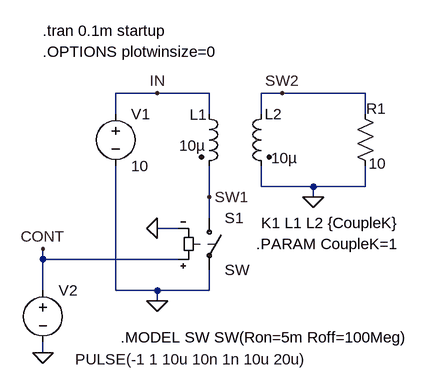
[diagram p0: schematic Fig_7-20_Inductor_SW-off_2A.asc]
Fig_7-20_Inductor_SW-off_2A.asc, the LTspice schematic file:
Version 4
SHEET 1 940 1020
WIRE 128 32 64 32
WIRE 208 32 128 32
WIRE 320 32 288 32
WIRE 448 32 320 32
WIRE 64 64 64 32
WIRE 208 64 208 32
WIRE 288 64 288 32
WIRE 448 64 448 32
WIRE 288 176 288 144
WIRE 368 176 288 176
WIRE 448 176 448 144
WIRE 448 176 368 176
WIRE 208 192 208 144
WIRE 368 192 368 176
WIRE 208 224 208 192
WIRE 160 240 128 240
WIRE -48 288 -48 272
WIRE 160 288 -48 288
WIRE -48 336 -48 288
WIRE 64 336 64 144
WIRE 128 336 64 336
WIRE 208 336 208 304
WIRE 208 336 128 336
WIRE 128 352 128 336
WIRE -48 432 -48 416
FLAG 128 352 0
FLAG 128 240 0
FLAG -48 272 CONT
FLAG -48 432 0
FLAG 208 192 SW1
FLAG 128 32 IN
FLAG 320 32 SW2
FLAG 368 192 0
SYMBOL voltage 64 48 R0
WINDOW 123 0 0 Left 2
WINDOW 39 0 0 Left 2
SYMATTR InstName V1
SYMATTR Value 10
SYMBOL ind2 192 48 R0
WINDOW 0 -14 17 Left 2
WINDOW 3 -30 65 Left 2
SYMATTR InstName L1
SYMATTR Value 10µ
SYMATTR Type ind
SYMBOL ind2 304 48 M0
WINDOW 0 -16 16 Left 2
WINDOW 3 -40 84 Left 2
SYMATTR InstName L2
SYMATTR Value 10µ
SYMATTR Type ind
SYMBOL res 464 160 R180
WINDOW 0 -16 104 Left 2
WINDOW 3 -16 20 Left 2
SYMATTR InstName R1
SYMATTR Value 10
SYMBOL sw 208 208 R0
SYMATTR InstName S1
SYMBOL voltage -48 320 R0
WINDOW 3 50 122 Left 2
WINDOW 123 0 0 Left 2
WINDOW 39 0 0 Left 2
SYMATTR Value PULSE(-1 1 10u 10n 1n 10u 20u)
SYMATTR InstName V2
TEXT -48 -64 Left 2 !.tran 0.1m startup
TEXT 72 408 Left 2 !.MODEL SW SW(Ron=5m Roff=100Meg)
TEXT 288 232 Left 2 !K1 L1 L2 {CoupleK}
TEXT -48 -32 Left 2 !.OPTIONS plotwinsize=0
TEXT 280 264 Left 2 !.PARAM CoupleK=1

The netlist it stands for:
* Fig_7-20_Inductor_SW-off_2A.asc
V1 IN 0 10
L1 IN SW1 10µ
L2 SW2 0 10µ
R1 0 SW2 10
S1 SW1 0 CONT 0 SW
V2 CONT 0 PULSE(-1 1 10u 10n 1n 10u 20u)
.tran 0.1m startup
.MODEL SW SW(Ron=5m Roff=100Meg)
K1 L1 L2 {CoupleK}
.OPTIONS plotwinsize=0
.PARAM CoupleK=1
.backanno
.end